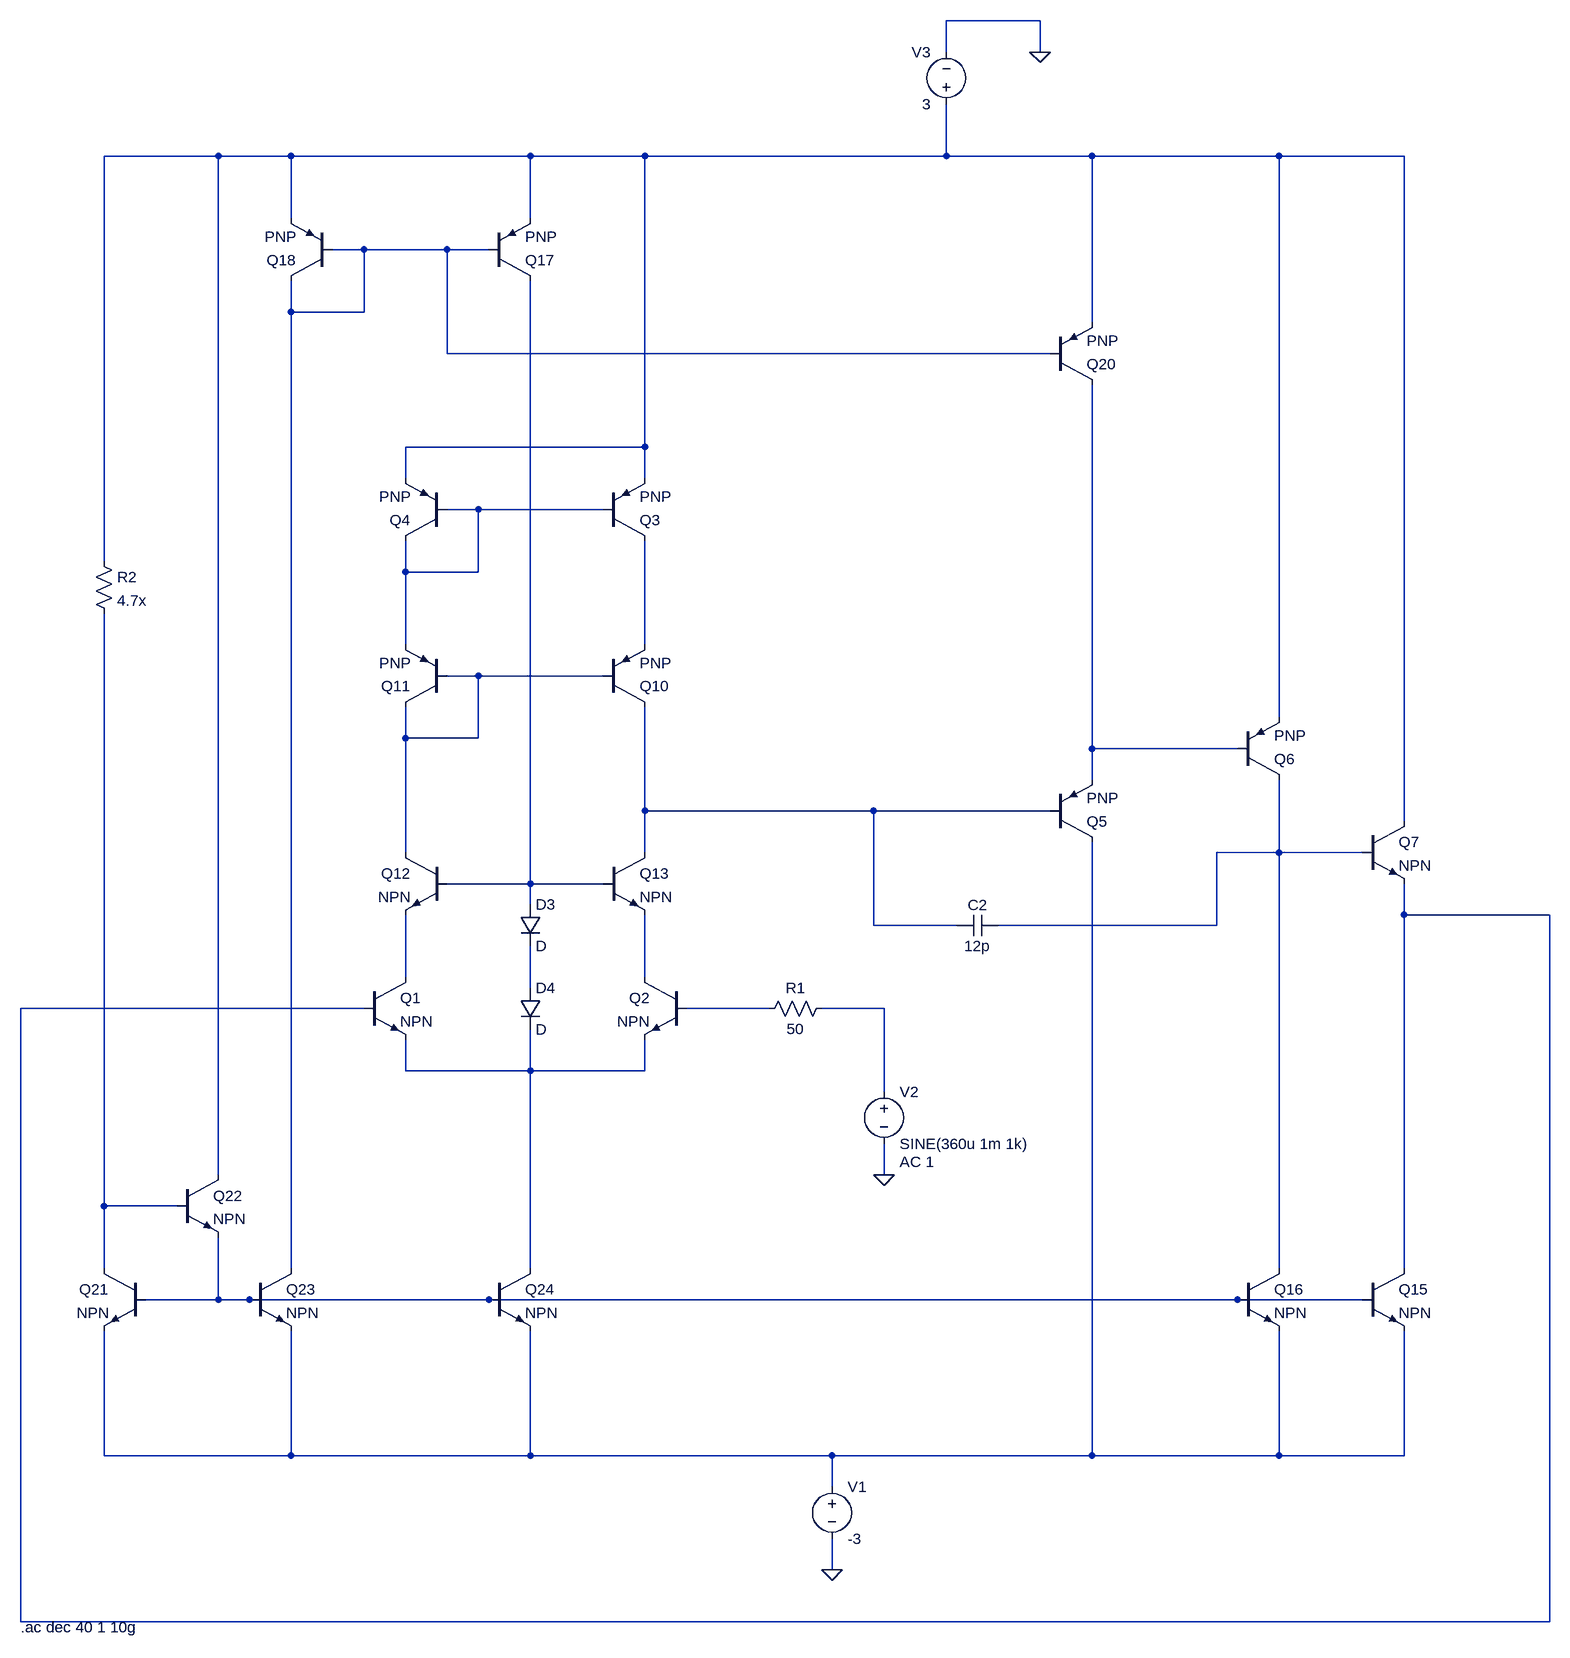
[diagram p0: schematic Project_final.asc]
Project_final.asc, the LTspice schematic file:
Version 4
SHEET 1 1652 1224
WIRE 384 -1264 240 -1264
WIRE 240 -1216 240 -1264
WIRE 384 -1216 384 -1264
WIRE -880 -1056 -1056 -1056
WIRE -768 -1056 -880 -1056
WIRE -400 -1056 -768 -1056
WIRE -224 -1056 -400 -1056
WIRE 240 -1056 240 -1136
WIRE 240 -1056 -224 -1056
WIRE 464 -1056 240 -1056
WIRE 752 -1056 464 -1056
WIRE 944 -1056 752 -1056
WIRE -768 -960 -768 -1056
WIRE -400 -960 -400 -1056
WIRE -656 -912 -704 -912
WIRE -528 -912 -656 -912
WIRE -464 -912 -528 -912
WIRE -768 -816 -768 -864
WIRE -656 -816 -656 -912
WIRE -656 -816 -768 -816
WIRE 464 -800 464 -1056
WIRE -528 -752 -528 -912
WIRE 400 -752 -528 -752
WIRE -224 -608 -224 -1056
WIRE -224 -608 -592 -608
WIRE -592 -560 -592 -608
WIRE -224 -560 -224 -608
WIRE -480 -512 -528 -512
WIRE -288 -512 -480 -512
WIRE -1056 -432 -1056 -1056
WIRE -592 -416 -592 -464
WIRE -480 -416 -480 -512
WIRE -480 -416 -592 -416
WIRE -592 -304 -592 -416
WIRE -224 -304 -224 -464
WIRE -480 -256 -528 -256
WIRE -288 -256 -480 -256
WIRE 752 -192 752 -1056
WIRE -592 -160 -592 -208
WIRE -480 -160 -480 -256
WIRE -480 -160 -592 -160
WIRE 464 -144 464 -704
WIRE 688 -144 464 -144
WIRE 464 -96 464 -144
WIRE -224 -48 -224 -208
WIRE 128 -48 -224 -48
WIRE 400 -48 128 -48
WIRE 944 -32 944 -1056
WIRE -592 16 -592 -160
WIRE -224 16 -224 -48
WIRE 752 16 752 -96
WIRE 752 16 656 16
WIRE 880 16 752 16
WIRE -400 64 -400 -864
WIRE -400 64 -528 64
WIRE -288 64 -400 64
WIRE -400 96 -400 64
WIRE 944 112 944 64
WIRE 1168 112 944 112
WIRE 128 128 128 -48
WIRE 256 128 128 128
WIRE 656 128 656 16
WIRE 656 128 320 128
WIRE -592 208 -592 112
WIRE -224 208 -224 112
WIRE -400 224 -400 160
WIRE -656 256 -1184 256
WIRE -32 256 -160 256
WIRE 144 256 48 256
WIRE -592 352 -592 304
WIRE -400 352 -400 288
WIRE -400 352 -592 352
WIRE -224 352 -224 304
WIRE -224 352 -400 352
WIRE 144 384 144 256
WIRE -880 512 -880 -1056
WIRE 144 512 144 464
WIRE -1056 560 -1056 -352
WIRE -944 560 -1056 560
WIRE -1056 656 -1056 560
WIRE -768 656 -768 -816
WIRE -400 656 -400 352
WIRE 752 656 752 16
WIRE 944 656 944 112
WIRE -880 704 -880 608
WIRE -880 704 -992 704
WIRE -832 704 -880 704
WIRE -464 704 -832 704
WIRE 688 704 -464 704
WIRE 880 704 688 704
WIRE -1056 944 -1056 752
WIRE -768 944 -768 752
WIRE -768 944 -1056 944
WIRE -400 944 -400 752
WIRE -400 944 -768 944
WIRE 64 944 -400 944
WIRE 464 944 464 0
WIRE 464 944 64 944
WIRE 752 944 752 752
WIRE 752 944 464 944
WIRE 944 944 944 752
WIRE 944 944 752 944
WIRE 64 992 64 944
WIRE 64 1120 64 1072
WIRE -1184 1200 -1184 256
WIRE 1168 1200 1168 112
WIRE 1168 1200 -1184 1200
FLAG 64 1120 0
FLAG 144 512 0
FLAG 384 -1216 0
SYMBOL npn -656 208 R0
SYMATTR InstName Q1
SYMBOL npn -160 208 M0
SYMATTR InstName Q2
SYMBOL pnp -288 -464 M180
SYMATTR InstName Q3
SYMBOL pnp -528 -464 R180
SYMATTR InstName Q4
SYMBOL pnp 400 0 M180
SYMATTR InstName Q5
SYMBOL pnp 688 -96 M180
SYMATTR InstName Q6
SYMBOL npn 880 -32 R0
SYMATTR InstName Q7
SYMBOL pnp -288 -208 M180
SYMATTR InstName Q10
SYMBOL pnp -528 -208 R180
SYMATTR InstName Q11
SYMBOL npn -528 16 M0
SYMATTR InstName Q12
SYMBOL npn -288 16 R0
SYMATTR InstName Q13
SYMBOL diode -416 96 R0
SYMATTR InstName D3
SYMBOL diode -416 224 R0
SYMATTR InstName D4
SYMBOL voltage 64 976 R0
WINDOW 123 0 0 Left 0
WINDOW 39 0 0 Left 0
SYMATTR InstName V1
SYMATTR Value -3
SYMBOL cap 320 112 R90
WINDOW 0 0 32 VBottom 2
WINDOW 3 32 32 VTop 2
SYMATTR InstName C2
SYMATTR Value 12p
SYMBOL npn 880 656 R0
SYMATTR InstName Q15
SYMBOL npn 688 656 R0
SYMATTR InstName Q16
SYMBOL voltage 144 368 R0
WINDOW 123 24 124 Left 2
WINDOW 39 0 0 Left 0
SYMATTR Value2 AC 1
SYMATTR InstName V2
SYMATTR Value SINE(360u 1m 1k)
SYMBOL pnp -464 -864 M180
SYMATTR InstName Q17
SYMBOL pnp -704 -864 R180
SYMATTR InstName Q18
SYMBOL voltage 240 -1120 R180
WINDOW 0 24 96 Left 2
WINDOW 3 24 16 Left 2
WINDOW 123 0 0 Left 0
WINDOW 39 0 0 Left 0
SYMATTR InstName V3
SYMATTR Value 3
SYMBOL pnp 400 -704 M180
SYMATTR InstName Q20
SYMBOL res 64 240 R90
WINDOW 0 0 56 VBottom 2
WINDOW 3 32 56 VTop 2
SYMATTR InstName R1
SYMATTR Value 50
SYMBOL npn -992 656 M0
SYMATTR InstName Q21
SYMBOL npn -944 512 R0
SYMATTR InstName Q22
SYMBOL npn -832 656 R0
SYMATTR InstName Q23
SYMBOL npn -464 656 R0
SYMATTR InstName Q24
SYMBOL res -1072 -448 R0
SYMATTR InstName R2
SYMATTR Value 4.7x
TEXT -1184 1208 Left 2 !.ac dec 40 1 10g

The netlist it stands for:
* Project_final.asc
Q1 N011 N010 N016 0 NPN
Q2 N012 N014 N016 0 NPN
Q3 N004 N003 N001 0 PNP
Q4 N003 N003 N001 0 PNP
Q5 N019 N007 N006 0 PNP
Q6 N008 N006 N001 0 PNP
Q7 N001 N008 N010 0 NPN
Q10 N007 N005 N004 0 PNP
Q11 N005 N005 N003 0 PNP
Q12 N005 N009 N011 0 NPN
Q13 N007 N009 N012 0 NPN
D3 N009 N013 D
D4 N013 N016 D
V1 N019 0 -3
C2 N008 N007 12p
Q15 N010 N018 N019 0 NPN
Q16 N008 N018 N019 0 NPN
V2 N015 0 SINE(360u 1m 1k) AC 1
Q17 N009 N002 N001 0 PNP
Q18 N002 N002 N001 0 PNP
V3 N001 0 3
Q20 N006 N002 N001 0 PNP
R1 N015 N014 50
Q21 N017 N018 N019 0 NPN
Q22 N001 N017 N018 0 NPN
Q23 N002 N018 N019 0 NPN
Q24 N016 N018 N019 0 NPN
R2 N001 N017 4.7x
.model D D
.lib standard.dio
.model NPN NPN
.model PNP PNP
.lib standard.bjt
.ac dec 40 1 10g
.backanno
.end